# Altium schematic sheet XMOS_TSBOARD_SPDIF.SchDoc
size A4; DocumentNumber: 6; SheetNumber: 6; SheetTotal: 8
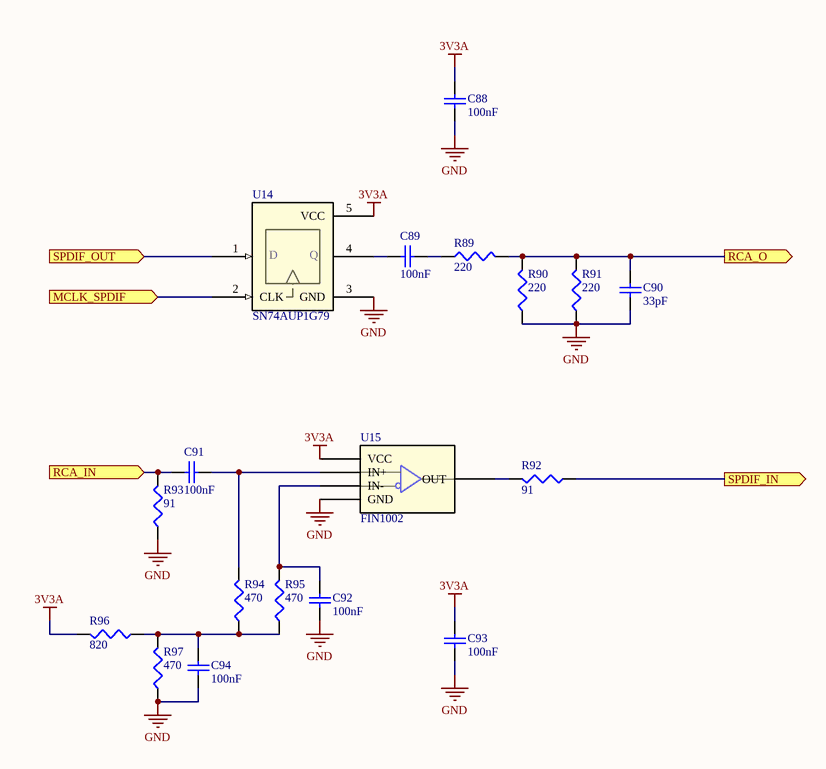
[diagram p0: XMOS_TSBOARD_SPDIF.SchDoc]

## Parts
C88  value 100nF  [1608[0603]]  (hidden comment: Cap Semi)
C89  value 100nF  [1608[0603]]  (hidden comment: Cap Semi)
C90  value 33pF  [1608[0603]]  (hidden comment: Cap Semi)
C91  value 100nF  [1608[0603]]  (hidden comment: Cap Semi)
C92  value 100nF  [1608[0603]]  (hidden comment: Cap Semi)
C93  value 100nF  [1608[0603]]  (hidden comment: Cap Semi)
C94  value 100nF  [1608[0603]]  (hidden comment: Cap Semi)
R89  value 220  [J1-0603]  (hidden comment: Res3)
R90  value 220  [J1-0603]  (hidden comment: Res3)
R91  value 220  [J1-0603]  (hidden comment: Res3)
R92  value 91  [J1-0603]  (hidden comment: Res3)
R93  value 91  [J1-0603]  (hidden comment: Res3)
R94  value 470  [J1-0603]  (hidden comment: Res3)
R95  value 470  [J1-0603]  (hidden comment: Res3)
R96  value 820  [J1-0603]  (hidden comment: Res3)
R97  value 470  [J1-0603]  (hidden comment: Res3)
U14  SN74AUP1G79  [DBV5]
U15  FIN1002  [DBV5]

## Ports
MCLK_SPDIF (in), RCA_IN (in), RCA_O (out), SPDIF_IN (out), SPDIF_OUT (in)

## Nets
3V3A: C88.2 C93.2 R96.2 U14.5(VCC) U15.1(VCC)
GND: C88.1 C90.1 C92.1 C93.1 C94.1 R90.1 R91.1 R93.1 R97.1 U14.3(GND) U15.2(GND)
MCLK_SPDIF: U14.2(CLK) ; port MCLK_SPDIF
RCA_IN: C91.1 R93.2 ; port RCA_IN
RCA_O: C90.2 R89.2 R90.2 R91.2 ; port RCA_O
SPDIF_IN: R92.1 ; port SPDIF_IN
SPDIF_OUT: U14.1(D) ; port SPDIF_OUT
NetC89_1: C89.1 U14.4(Q)
NetC89_2: C89.2 R89.1
NetC91_2: C91.2 R94.2 U15.3(IN+)
NetC92_2: C92.2 R95.2 U15.4(IN-)
NetC94_2: C94.2 R94.1 R95.1 R96.1 R97.2
NetR92_2: R92.2 U15.5(OUT)

## Library data of the parts
C88-C94 = Cap Semi: Capacitor (Semiconductor SIM Model); Published: 8-Jun-2000; LatestRevisionDate: 29-May-2009; LatestRevisionNote: IPC-7351 Footprint Added.; PackageReference: C1206; Publisher: Altium Limited; PackageDescription: Chip Capacitor
R89-R97 = Res3: Resistor; Published: 8-Jun-2000; LatestRevisionDate: 29-May-2009; LatestRevisionNote: IPC-7351 Footprint Added.; PackageReference: J1-0603; Publisher: Altium Limited; PackageDescription: Chip Resistor
U14 = SN74AUP1G79: Low-Power Single Positive-Edge-Triggered D-Type Flip-Flop
U15 = FIN1002: LVDS 1-Bit High Speed Differential Receiver